# Altium schematic sheet Modem.SchDoc
size A4
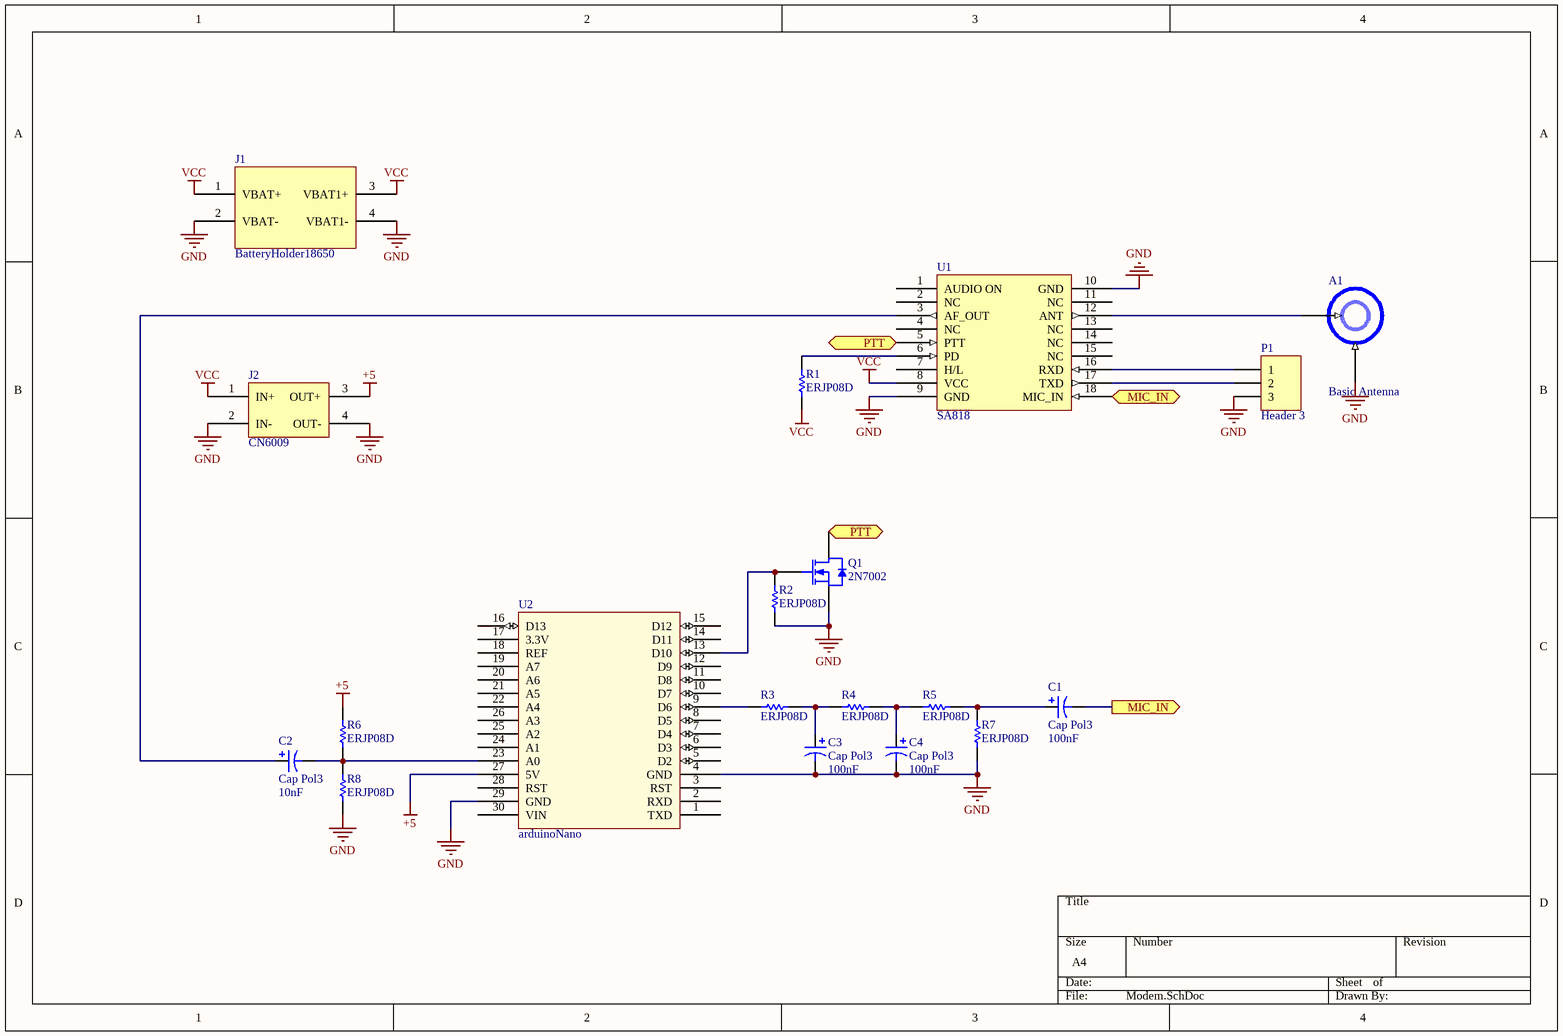
[diagram p0: Modem.SchDoc]

## Parts
A1  Basic Antenna  [CON-SMA-EDGE062]
C1  Cap Pol3  value 100nF  [C0805]
C2  Cap Pol3  value 10nF  [C0805]
C3  Cap Pol3  value 100nF  [C0805]
C4  Cap Pol3  value 100nF  [C0805]
J1  BatteryHolder18650  [BatteryHolder18650]
J2  CN6009  [CN6009]
P1  Header 3  [HDR1X3]
Q1  2N7002  [SOT23_N]
R1  ERJP08D  [8-1206]
R2  ERJP08D  [8-1206]
R3  ERJP08D  [8-1206]
R4  ERJP08D  [8-1206]
R5  ERJP08D  [8-1206]
R6  ERJP08D  [8-1206]
R7  ERJP08D  [8-1206]
R8  ERJP08D  [8-1206]
U1  SA818  [SA818]
U2  arduinoNano  [Arduino nano]

## Ports
MIC_IN (in), MIC_IN (out), PTT (in), PTT (out)

## Nets
+5: J2.3(OUT+) R6.2 U2.27(5V)
GND: A1.G(Ground) C3.2 C4.2 J1.2(VBAT-) J1.4(VBAT1-) J2.2(IN-) J2.4(OUT-) P1.3 Q1.2(S) R2.1 R7.2 R8.1 U1.9(GND) U1.10(GND) U2.4(GND) U2.29(GND)
VCC: J1.1(VBAT+) J1.3(VBAT1+) J2.1(IN+) R1.2 U1.8(VCC)
MIC_IN: C1.2 U1.18(MIC_IN) ; port MIC_IN
PTT: Q1.3(D) U1.5(PTT) ; port PTT
NetA1_S: A1.S(Signal) U1.12(ANT)
NetC1_1: C1.1 R5.2 R7.1
NetC2_1: C2.1 U1.3(AF_OUT)
NetC2_2: C2.2 R6.1 R8.2 U2.23(A0)
NetC3_1: C3.1 R3.1 R4.2
NetC4_1: C4.1 R4.1 R5.1
NetP1_1: P1.1 U1.16(RXD)
NetP1_2: P1.2 U1.17(TXD)
NetQ1_1: Q1.1(G) R2.2 U2.13(D10)
NetR1_1: R1.1 U1.6(PD)
NetR3_2: R3.2 U2.9(D6)

Not connected (* = marked no-connect by the designer): U1 1(AUDIO_ON) 2(NC) 4(NC) 7(H/L) 11(NC) 13(NC) 14(NC) 15(NC); U2 1(TXD) 2(RXD) 3(RST) 5(D2) 6(D3) 7(D4) 8(D5) 10(D7) 11(D8) 12(D9) 14(D11) 15(D12) 16(D13) 17(3.3V) 18(REF) 19(A7) 20(A6) 21(A5) 22(A4) 24(A1) 25(A2) 26(A3) 28(RST) 30(VIN)

## Library data of the parts
C1-C4 = Cap Pol3: Polarized Capacitor (Surface Mount); Published: 8-Jun-2000; LatestRevisionDate: 29-May-2009; LatestRevisionNote: IPC-7351 Footprint Added.; PackageReference: C0805; Publisher: Altium Limited; PackageDescription: Chip Capacitor
P1 = Header 3: Header, 3-Pin; LatestRevisionDate: 17-Jul-2002; LatestRevisionNote: Re-released for DXP Platform.; Publisher: Altium Limited
Q1 = 2N7002: N-channel Enhancement Mode Field-effect Transistor; Published: 17-Sep-2003; LatestRevisionDate: 12-Dec-2006; LatestRevisionNote: IPC-7351 Footprint Added.; DatasheetVersion: 27-Jul-2000; PackageVersion: May-1999; PackageReference: SOT23; Publisher: Altium Limited; PackageDescription: 3-Pin SOT-23 Package 0.95 mm Pitch, 2.3 mm Lead Span; ComponentLink1Description: Manufacturer Link; ComponentLink1URL: http://www.semiconductors.philips.com/; ComponentLink2Description: Datasheet; ComponentLink2URL: http://www.semiconductors.philips.com/acrobat/datasheets/2N7002_4.pdf
R1-R8 = ERJP08D: Anti-Surge Thick Film Chip Resistor, 10 Ohm to 1M Ohm Range, 0.5% Tolerance, 1206 Size, 0.25 W; Note: If flow soldering, adjust pad width of PCB Footprint to 0.7 - 0.8 times the width of the resistor.; Published: 17-Dec-2003; LatestRevisionDate: 19-Mar-2004; LatestRevisionNote: Silkscreen size reduced.; PackageDocument: Mar-2003; PackageReference: 8-1206; Publisher: Altium Limited; Code_IPC: 3216 [1206]; ComponentLink1Description: Manufacturer Link; ComponentLink1URL: http://www.panasonic.com/industrial/components/resistive_products.htm; ComponentLink2Description: Datasheet; ComponentLink2URL: http://www.panasonic.com/industrial/components/pdf/AOA0000CE4.pdf